# Altium schematic sheet 2020-08-19_08-57-041.schdoc
size 406 x 228 mm; SheetNumber: 1; SheetTotal: 1
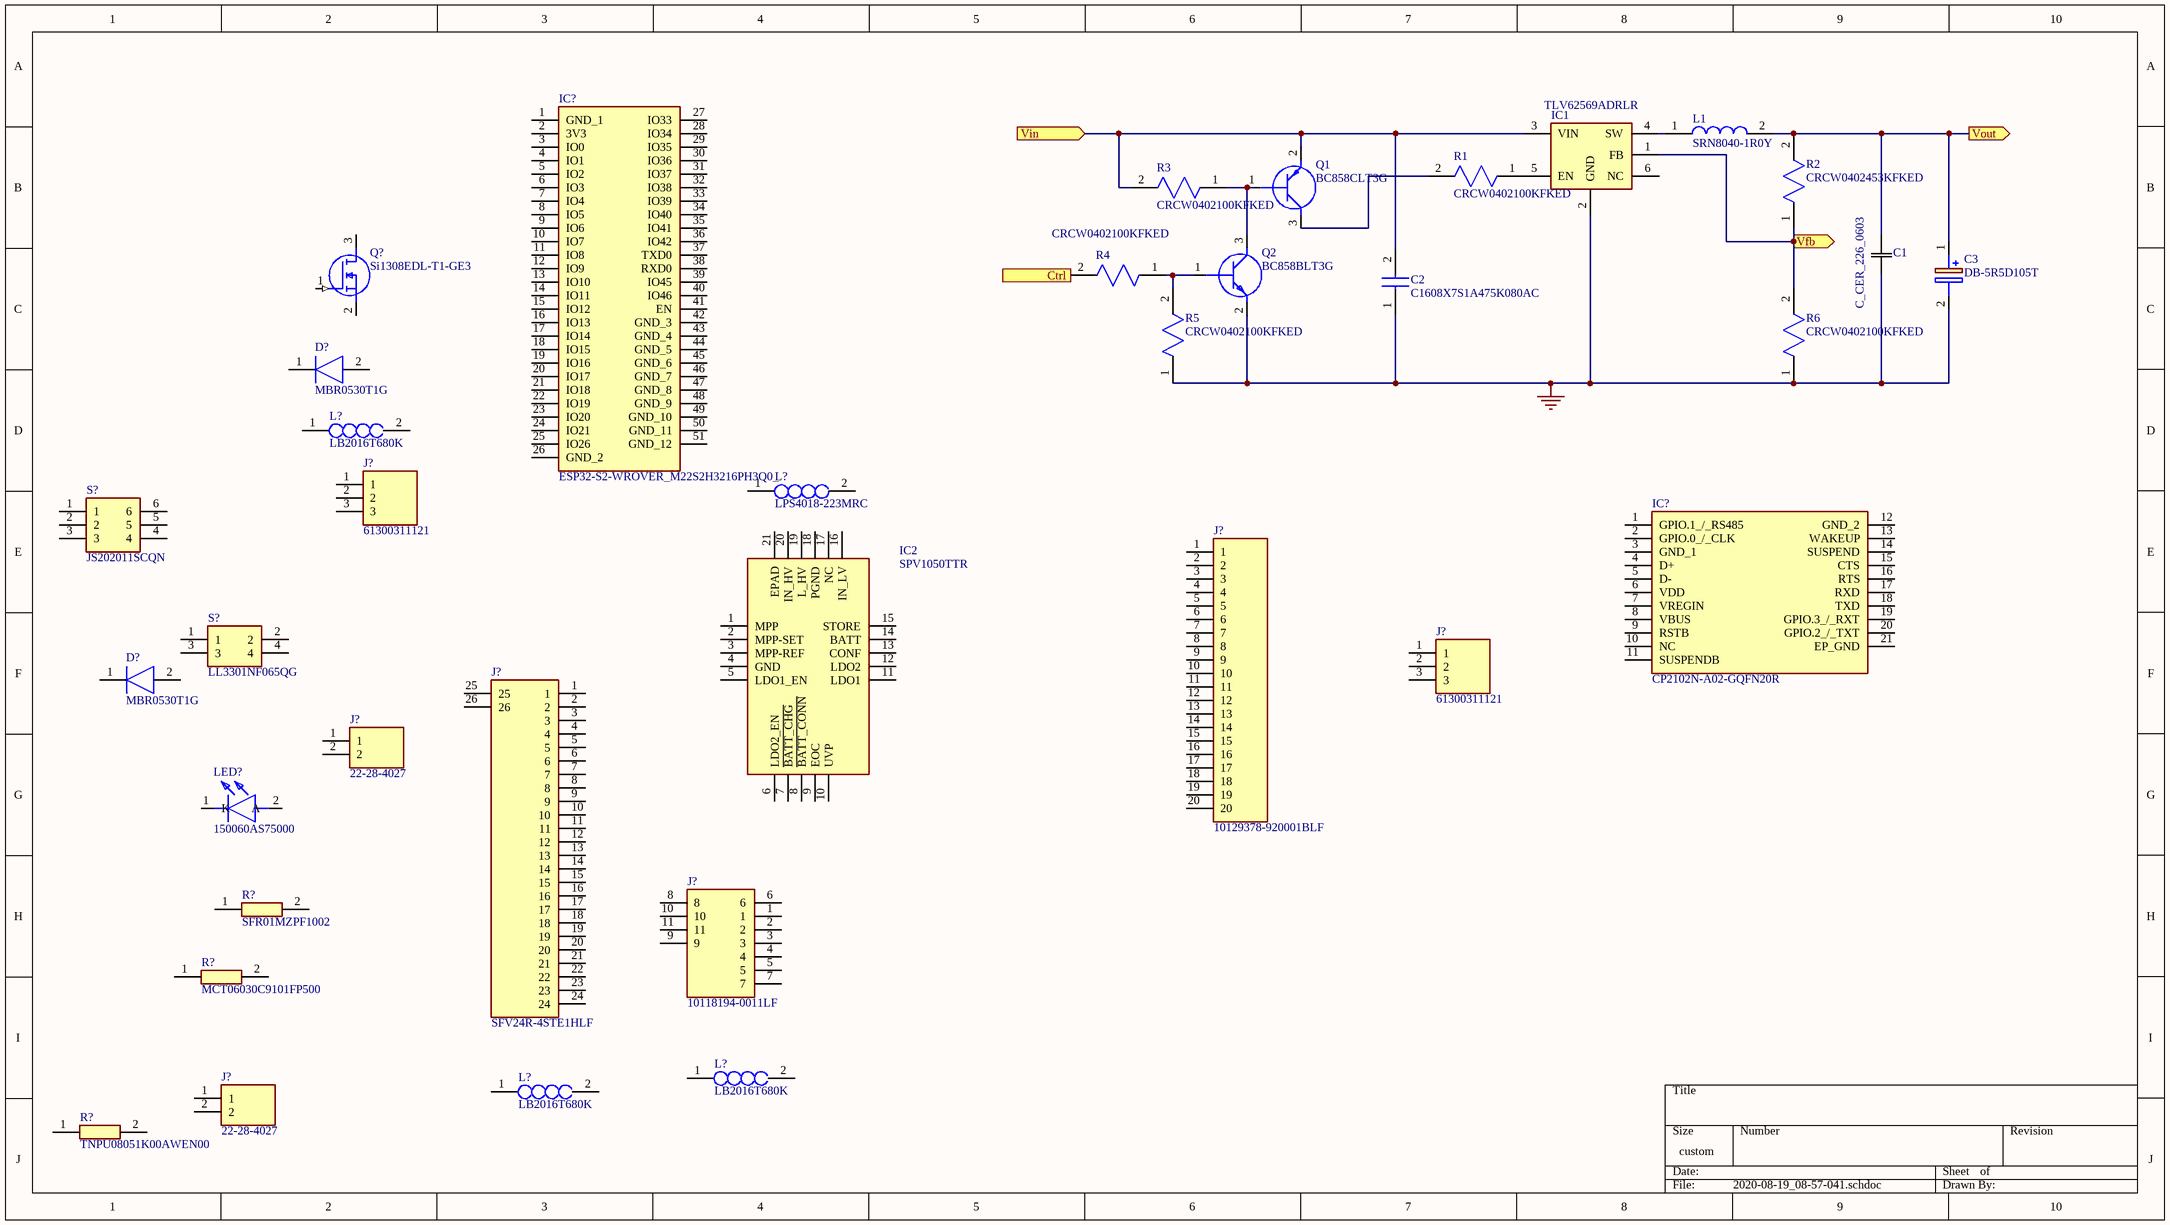
[diagram p0: 2020-08-19_08-57-041.schdoc]

## Parts
(Parts that share a designator on the sheet are numbered #1, #2 ... from top to bottom, then left to right.)
C1  C_CER_226_0603  [CAPC1005X70N]
C2  C1608X7S1A475K080AC  [CAPC1608X90N]
C3  DB-5R5D105T  [CAPPRD500W130D2150H800]
D?#1  MBR0530T1G  [SOD3716X135N]
D?#2  MBR0530T1G  [SOD3716X135N]
IC1  TLV62569ADRLR  [SOTFL50P160X60-6N]
IC2  SPV1050TTR  [QFN40P300X300X100-21N-D]
IC?#1  ESP32-S2-WROVER_M22S2H3216PH3Q0_  [ESP32S2WROVERM22S2H3216PH3Q0]
IC?#2  CP2102N-A02-GQFN20R  [CP2102NA02GQFN20]
J?#1  61300311121  [HDRV3W95P0X254_1X3_762X254X869P]
J?#2  10129378-920001BLF  [HDRV20W67P0X254_1X20_5080X241X858P]
J?#3  61300311121  [HDRV3W95P0X254_1X3_762X254X869P]
J?#4  SFV24R-4STE1HLF  [SFV24R4STE1HLF]
J?#5  22-28-4027  [HDRV2W66P0X254_1X2_508X249X1067P]
J?#6  10118194-0011LF  [101181940011LF]
J?#7  22-28-4027  [HDRV2W66P0X254_1X2_508X249X1067P]
L1  SRN8040-1R0Y  [SRN80408R2Y]
L?#1  LB2016T680K  [INDC2218X180N]
L?#2  LPS4018-223MRC  [LPS4018223MRC]
L?#3  LB2016T680K  [INDC2218X180N]
L?#4  LB2016T680K  [INDC2218X180N]
LED?  150060AS75000  [LEDC1608X80N]
Q1  BC858CLT3G  [BC858CLT3G]
Q2  BC858BLT3G  [SOT96P237X111-3N]
Q?  Si1308EDL-T1-GE3  [SOT65P210X110-3N]
R1  CRCW0402100KFKED  [RESC1005X40N]
R2  CRCW0402453KFKED  [RESC1005X40N]
R3  CRCW0402100KFKED  [RESC1005X40N]
R4  CRCW0402100KFKED  [RESC1005X40N]
R5  CRCW0402100KFKED  [RESC1005X40N]
R6  CRCW0402100KFKED  [RESC1005X40N]
R?#1  SFR01MZPF1002  [RESC1005X40N]
R?#2  MCT06030C9101FP500  [RESC1608X55N]
R?#3  TNPU08051K00AWEN00  [RESC2012X55N]
S?#1  JS202011SCQN  [JS202011SCQN]
S?#2  LL3301NF065QG  [LL3301NF065QG]

## Ports
Ctrl (in), Vfb (out), Vin (in), Vout (out)

## Nets
0: C1.1 C2.1 C3.2(-) IC1.2(GND) Q2.2(E) R5.1 R6.1
Ctrl: R4.2 ; port Ctrl
Vfb: IC1.1(FB) R2.1 R6.2 ; port Vfb
Vin: C2.2 IC1.3(VIN) Q1.2(E) R3.2 ; port Vin
Vout: C1.2 C3.1(+) L1.2 R2.2 ; port Vout
NetIC1_4: IC1.4(SW) L1.1
NetIC1_5: IC1.5(EN) R1.1
NetQ1_1: Q1.1(B) Q2.3(C) R3.1
NetQ1_3: Q1.3(C) R1.2
NetQ2_1: Q2.1(B) R4.1 R5.2

Not connected (* = marked no-connect by the designer): D?#1 1(K) 2(A); D?#2 1(K) 2(A); IC1 6(NC); IC2 1(MPP) 2(MPP-SET) 3(MPP-REF) 4(GND) 5(LDO1_EN) 6(LDO2_EN) 7(~{BATT_CHG}) 8(~{BATT_CONN}) 9(EOC) 10(UVP) 11(LDO1) 12(LDO2) 13(CONF) 14(BATT) 15(STORE) 16(IN_LV) 17(NC) 18(PGND) 19(L_HV) 20(IN_HV) 21(EPAD); IC?#1 1(GND_1) 2(3V3) 3(IO0) 4(IO1) 5(IO2) 6(IO3) 7(IO4) 8(IO5) 9(IO6) 10(IO7) 11(IO8) 12(IO9) 13(IO10) 14(IO11) 15(IO12) 16(IO13) 17(IO14) 18(IO15) 19(IO16) 20(IO17) 21(IO18) 22(IO19) 23(IO20) 24(IO21) 25(IO26) 26(GND_2) 27(IO33) 28(IO34) 29(IO35) 30(IO36) 31(IO37) 32(IO38) 33(IO39) 34(IO40) 35(IO41) 36(IO42) 37(TXD0) 38(RXD0) 39(IO45) 40(IO46) 41(EN) 42(GND_3) 43(GND_4) 44(GND_5) 45(GND_6) 46(GND_7) 47(GND_8) 48(GND_9) 49(GND_10) 50(GND_11) 51(GND_12); IC?#2 1(GPIO.1_/_RS485) 2(GPIO.0_/_CLK) 3(GND_1) 4(D+) 5(D-) 6(VDD) 7(VREGIN) 8(VBUS) 9(RSTB) 10(NC) 11(SUSPENDB) 12(GND_2) 13(WAKEUP) 14(SUSPEND) 15(CTS) 16(RTS) 17(RXD) 18(TXD) 19(GPIO.3_/_RXT) 20(GPIO.2_/_TXT) 21(EP_GND); J?#1 1 2 3; J?#2 1 2 3 4 5 6 7 8 9 10 11 12 13 14 15 16 17 18 19 20; J?#3 1 2 3; J?#4 1 2 3 4 5 6 7 8 9 10 11 12 13 14 15 16 17 18 19 20 21 22 23 24 25 26; J?#5 1 2; J?#6 1 2 3 4 5 6 7 8 9 10 11; J?#7 1 2; L?#1 1 2; L?#2 1 2; L?#3 1 2; L?#4 1 2; LED? 1(K) 2(A); Q? 1(G) 2(S) 3(D); R?#1 1 2; R?#2 1 2; R?#3 1 2; S?#1 1 2 3 4 5 6; S?#2 1 2 3 4

## Library data of the parts
C1 = C_CER_226_0603: Manufacturer_Part_Number: GRM188R60J226MEA0D; Vendor: Murata; SourceLibrary: Murata_2014-12-31; Type: DEV; Copyright: Copyright (C) 2015 Accelerated Designs. All rights reserved; RefDes: RefDes
C2 = C1608X7S1A475K080AC: Capacitor; Manufacturer_Name: TDK; Datasheet Link: https://product.tdk.com/info/en/catalog/datasheets/mlcc_commercial_midvoltage_en.pdf; Height: 0.9mm; Manufacturer_Part_Number: C1608X7S1A475K080AC
C3 = DB-5R5D105T: Capacitor Polarised; Manufacturer_Name: Elna; Datasheet Link: https://componentsearchengine.com//DB-5R5D105T.pdf; Height: 8mm; Mouser2 Part Number: 555-DB-5R5D105T; Mouser2 Price/Stock: https://www.mouser.com/Search/Refine.aspx?Keyword=555-DB-5R5D105T; Manufacturer_Part_Number: DB-5R5D105T
D?#1 D?#2 = MBR0530T1G: Diode; Manufacturer_Name: ON Semiconductor; Datasheet Link: https://componentsearchengine.com//MBR0530T1G.pdf; Height: 1.35mm; Mouser2 Part Number: 863-MBR0530T1G; Mouser2 Price/Stock: https://www.mouser.com/Search/Refine.aspx?Keyword=863-MBR0530T1G; Manufacturer_Part_Number: MBR0530T1G
IC1 = TLV62569ADRLR: Integrated Circuit; Manufacturer_Name: Texas Instruments; Datasheet Link: http://www.ti.com/lit/gpn/tlv62569a; Height: 0.6mm; Manufacturer_Part_Number: TLV62569ADRLR
IC2 = SPV1050TTR: Integrated Circuit; Manufacturer_Name: STMicroelectronics; Datasheet Link: https://componentsearchengine.com//SPV1050TTR.pdf; Height: 1mm; Mouser2 Part Number: 511-SPV1050TTR; Mouser2 Price/Stock: https://www.mouser.com/Search/Refine.aspx?Keyword=511-SPV1050TTR; Manufacturer_Part_Number: SPV1050TTR
IC?#1 = ESP32-S2-WROVER_M22S2H3216PH3Q0_: Integrated Circuit; Manufacturer_Name: Espressif Systems; Manufacturer_Part_Number: ESP32-S2-WROVER(M22S2H3216PH3Q0); Datasheet Link: https://www.espressif.com/sites/default/files/documentation/esp32-s2-wrover_esp32-s2-wrover-i_datasheet_en.pdf; Height: 3.45mm
IC?#2 = CP2102N-A02-GQFN20R: Integrated Circuit; Manufacturer_Name: Silicon Labs; Datasheet Link: https://componentsearchengine.com//CP2102N-A02-GQFN20R.pdf; Height: 0.8mm; Mouser2 Part Number: 634-CP2102NA02QFN20R; Mouser2 Price/Stock: https://www.mouser.com/Search/Refine.aspx?Keyword=634-CP2102NA02QFN20R; Manufacturer_Part_Number: CP2102N-A02-GQFN20R
J?#1 J?#3 = 61300311121: Connector; Manufacturer_Name: Wurth Elektronik; Datasheet Link: https://componentsearchengine.com//61300311121.pdf; Height: 8.69mm; Mouser2 Part Number: 710-61300311121; Mouser2 Price/Stock: https://www.mouser.com/Search/Refine.aspx?Keyword=710-61300311121; Manufacturer_Part_Number: 61300311121
J?#2 = 10129378-920001BLF: Connector; Manufacturer_Name: Amphenol; Datasheet Link: https://cdn.amphenol-icc.com/media/wysiwyg/files/drawing/10129378.pdf; Height: 8.58mm; Manufacturer_Part_Number: 10129378-920001BLF
J?#4 = SFV24R-4STE1HLF: Connector; Manufacturer_Name: Amphenol; Datasheet Link: https://www.mouser.co.uk/datasheet/2/18/10117319-1361747.pdf; Height: 2mm; Manufacturer_Part_Number: SFV24R-4STE1HLF
J?#5 J?#7 = 22-28-4027: Connector; Manufacturer_Name: Molex; Datasheet Link: https://componentsearchengine.com//22-28-4027.pdf; Height: 10.67mm; Mouser2 Part Number: 538-22-28-4027; Mouser2 Price/Stock: https://www.mouser.com/Search/Refine.aspx?Keyword=538-22-28-4027; Manufacturer_Part_Number: 22-28-4027
J?#6 = 10118194-0011LF: Connector; Manufacturer_Name: Amphenol; Datasheet Link: https://cdn.amphenol-icc.com/media/wysiwyg/files/drawing/10118194.pdf; Height: 2mm; Manufacturer_Part_Number: 10118194-0011LF
L1 = SRN8040-1R0Y: Inductor; Manufacturer_Name: Bourns; Datasheet Link: https://www.bourns.com/pdfs/SRN8040.pdf; Height: 4mm; Manufacturer_Part_Number: SRN8040-1R0Y
L?#1 L?#3 L?#4 = LB2016T680K: Inductor; Manufacturer_Name: TAIYO YUDEN; Datasheet Link: https://www.arrow.com/en/products/lb2016t680k/taiyo-yuden; Height: 1.8mm; Manufacturer_Part_Number: LB2016T680K; Arrow Part Number: LB2016T680K
L?#2 = LPS4018-223MRC: Inductor; Manufacturer_Name: COILCRAFT; Datasheet Link: https://componentsearchengine.com//LPS4018-223MRC.pdf; Height: 1.8mm; Mouser2 Part Number: 994-LPS4018-223MRC; Mouser2 Price/Stock: https://www.mouser.com/Search/Refine.aspx?Keyword=994-LPS4018-223MRC; Manufacturer_Part_Number: LPS4018-223MRC
LED? = 150060AS75000: LED; Manufacturer_Name: Wurth Elektronik; Datasheet Link: https://componentsearchengine.com/Datasheets/2/150060AS75000.pdf; Height: 0.8mm; Manufacturer_Part_Number: 150060AS75000
Q1 = BC858CLT3G: Transistor BJT PNP; Manufacturer_Name: ON Semiconductor; Datasheet Link: https://componentsearchengine.com//BC858CLT3G.pdf; Mouser2 Part Number: 863-BC858CLT3G; Mouser2 Price/Stock: https://www.mouser.com/Search/Refine.aspx?Keyword=863-BC858CLT3G; Manufacturer_Part_Number: BC858CLT3G
Q2 = BC858BLT3G: Transistor BJT PNP; Manufacturer_Name: ON Semiconductor; Datasheet Link: https://www.onsemi.com/pub/Collateral/BC856ALT1-D.PDF; Height: 1.11mm; Manufacturer_Part_Number: BC858BLT3G
Q? = Si1308EDL-T1-GE3: MOSFET (N-Channel); Manufacturer_Name: Vishay; Datasheet Link: https://componentsearchengine.com//SI1308EDL-T1-GE3.pdf; Height: 1.1mm; Mouser2 Part Number: 78-SI1308EDL-T1-GE3; Mouser2 Price/Stock: https://www.mouser.com/Search/Refine.aspx?Keyword=78-SI1308EDL-T1-GE3; Manufacturer_Part_Number: Si1308EDL-T1-GE3
R1 R3-R6 = CRCW0402100KFKED: Resistor; Manufacturer_Name: Vishay; Datasheet Link: http://www.vishay.com/docs/20035/dcrcwe3.pdf; Height: 0.4mm; Manufacturer_Part_Number: CRCW0402100KFKED
R2 = CRCW0402453KFKED: Resistor; Manufacturer_Name: Vishay; Datasheet Link: http://www.vishay.com/docs/20035/dcrcwe3.pdf; Height: 0.4mm; Manufacturer_Part_Number: CRCW0402453KFKED
R?#1 = SFR01MZPF1002: Resistor; Manufacturer_Name: ROHM Semiconductor; Datasheet Link: https://componentsearchengine.com/Datasheets/1/SFR01MZPF1002.pdf; Height: 0.4mm; Manufacturer_Part_Number: SFR01MZPF1002
R?#2 = MCT06030C9101FP500: Resistor; Manufacturer_Name: Vishay; Datasheet Link: http://www.vishay.com/docs/28705/mcx0x0xpro.pdf; Height: 0.55mm; Manufacturer_Part_Number: MCT06030C9101FP500
R?#3 = TNPU08051K00AWEN00: Resistor; Manufacturer_Name: Vishay; Datasheet Link: https://www.mouser.es/ProductDetail/Vishay-Dale/TNPU08051K00AWEN00?qs=sGAEpiMZZMvdGkrng054twKDKoBh%252Bscnwh7yGacEGgbYsiveq1NCcg%3D%3D; Height: 0.55mm; Manufacturer_Part_Number: TNPU08051K00AWEN00
S?#1 = JS202011SCQN: Switch; Manufacturer_Name: C & K COMPONENTS; Datasheet Link: https://componentsearchengine.com//JS202011SCQN.pdf; Mouser2 Part Number: 611-JS202011SCQN; Mouser2 Price/Stock: https://www.mouser.com/Search/Refine.aspx?Keyword=611-JS202011SCQN; Manufacturer_Part_Number: JS202011SCQN
S?#2 = LL3301NF065QG: Switch; Manufacturer_Name: E-Switch; Datasheet Link: https://componentsearchengine.com//LL3301NF065QG.pdf; Height: 4mm; Mouser2 Part Number: 612-LL3301NF065QG; Mouser2 Price/Stock: https://www.mouser.com/Search/Refine.aspx?Keyword=612-LL3301NF065QG; Manufacturer_Part_Number: LL3301NF065QG